# EasyEDA Pro project ProDoc_MotherBrd_2025-10-13.epro, schematic MotherBoard
Board Name: MotherBrd; Create Date: 2025-09-12; Page Name: P1; Project Name: STM32 Desktop Drumkit v1; Schematic Name: MotherBoard; Update Date: 2025-09-14; Company: CQUPT; Drawed: WilliTourt; Page Size: A4; Reviewed: WilliTourt; Version: V1.0
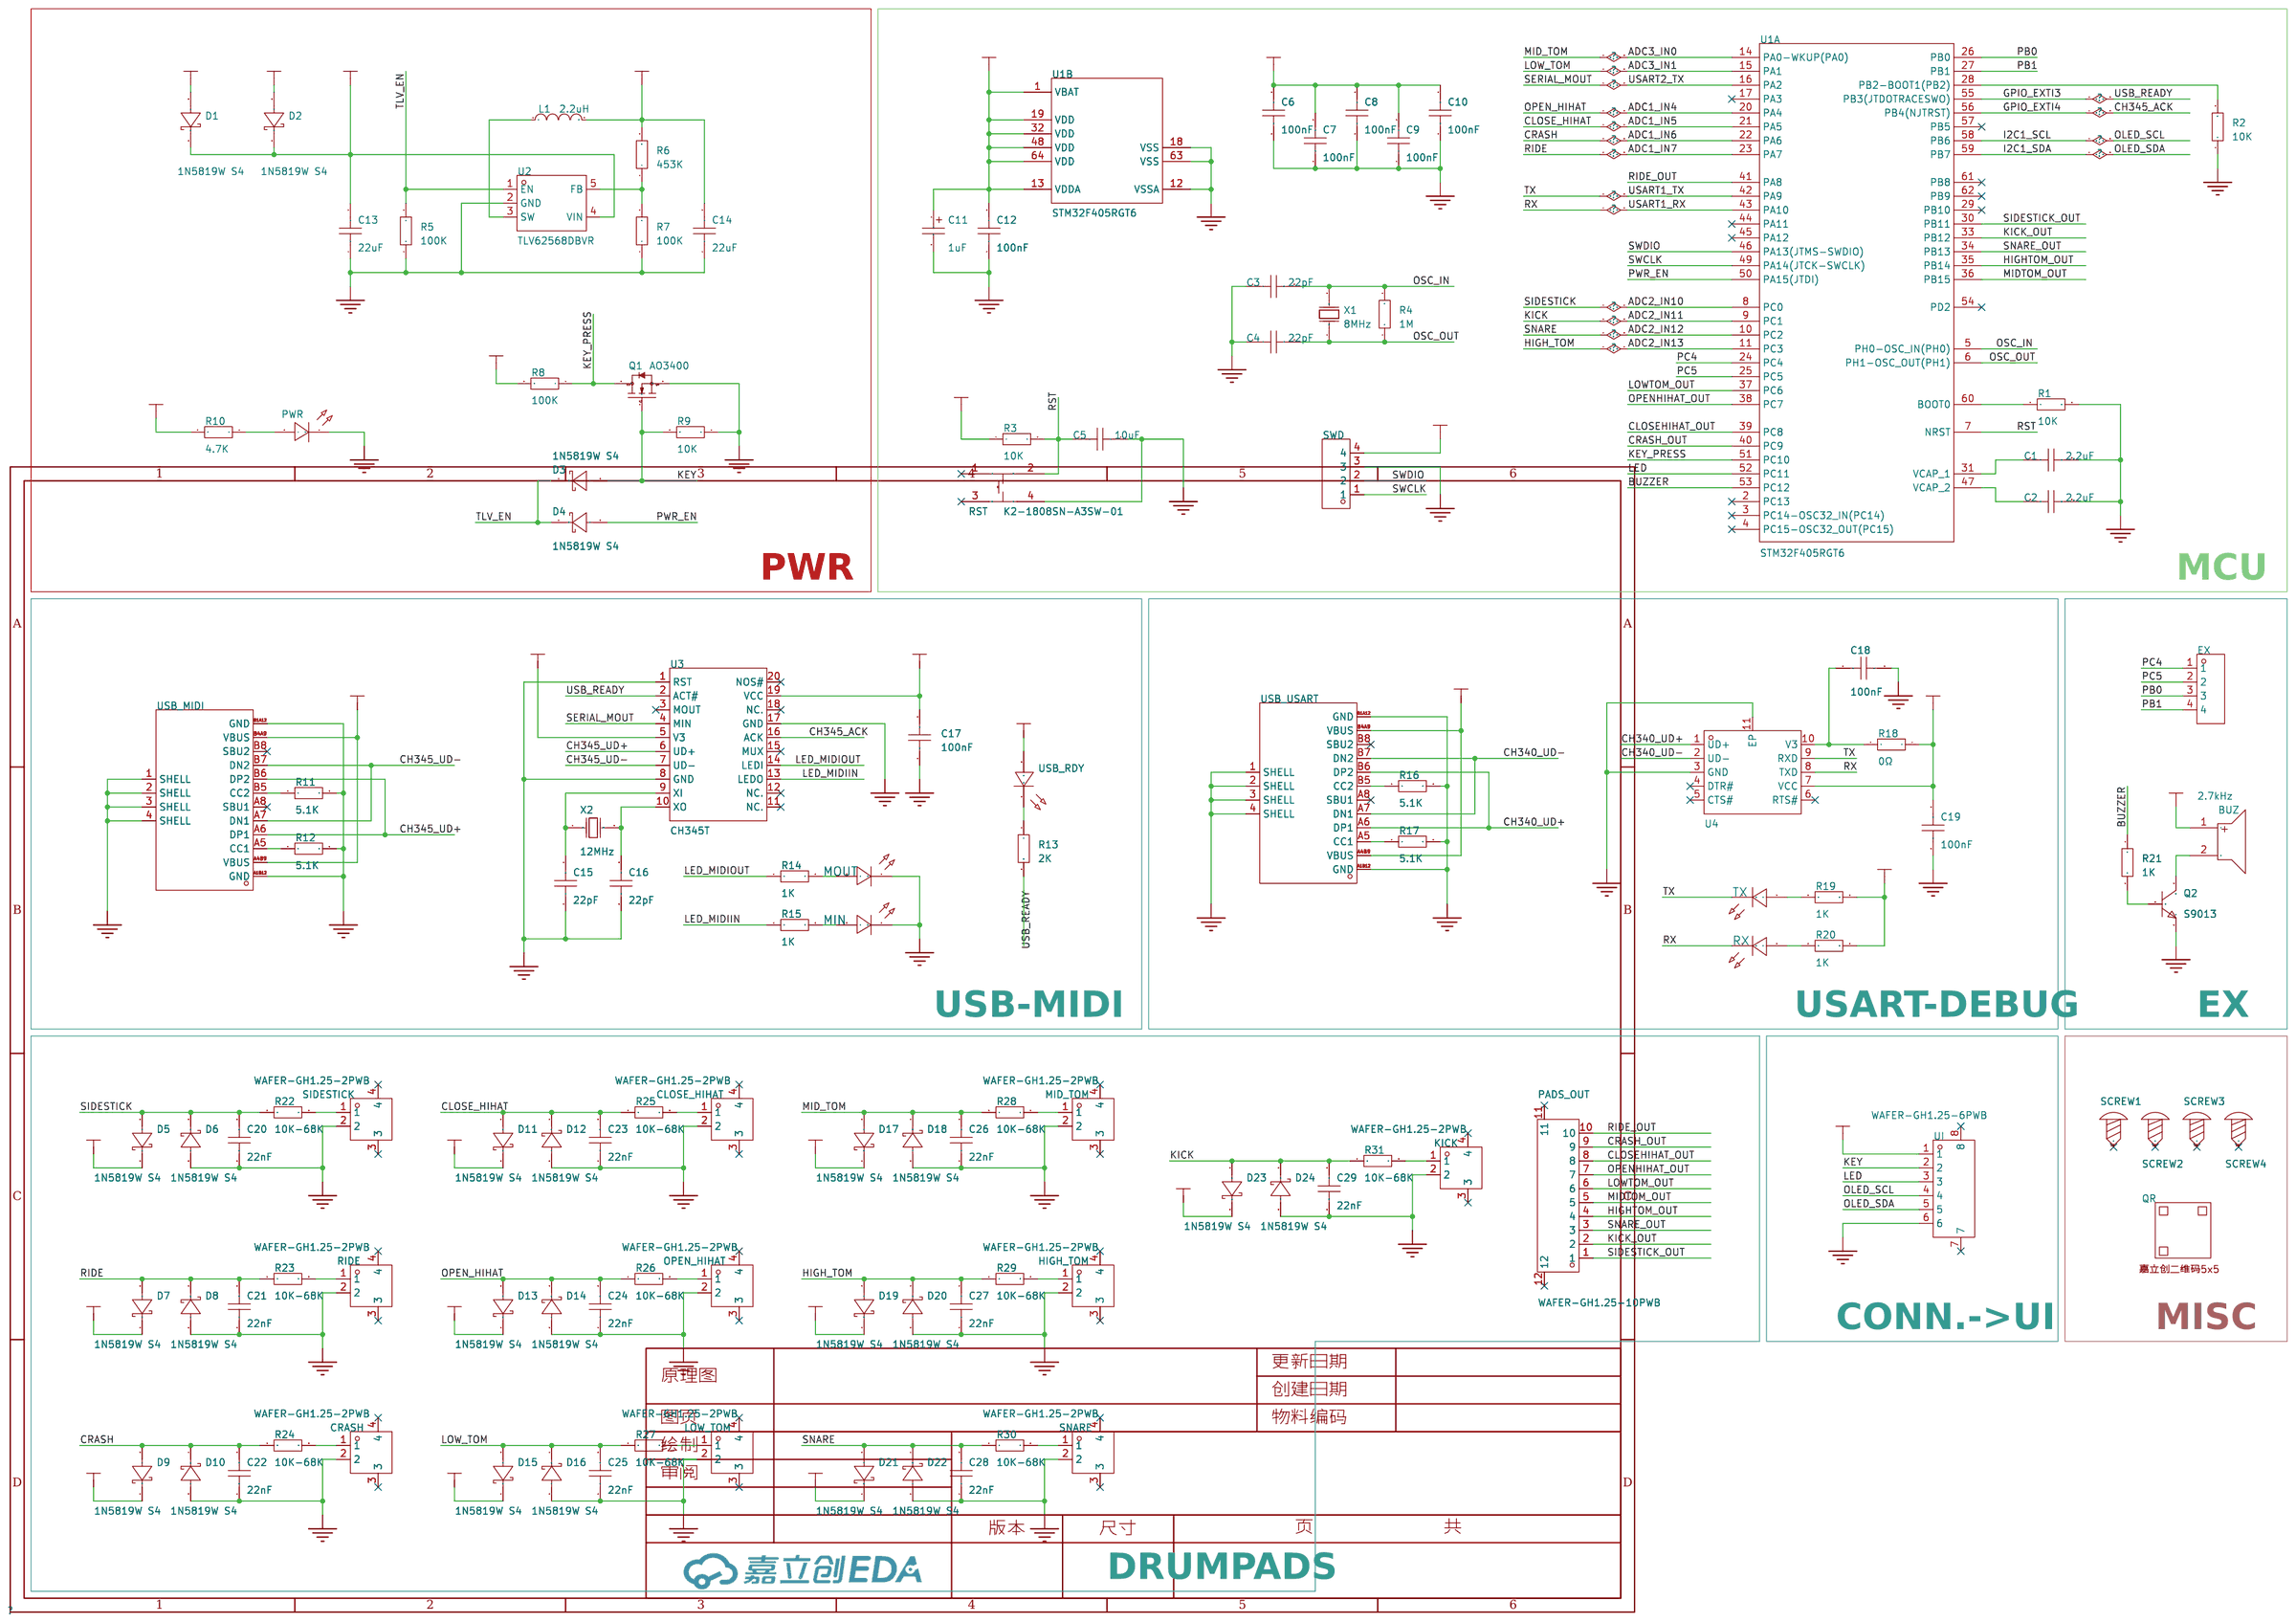
[diagram p0: schematic sheet]

## Parts
BUZ  2.7kHz  [BUZ-TH_BD9.0-P4.00-D0.6-FD]
C1  2.2uF  [C0603]
C2  2.2uF  [C0603]
C3  22pF  [C0603]
C4  22pF  [C0603]
C5  10uF  [C0603]
C6  100nF  [C0603]
C7  100nF  [C0603]
C8  100nF  [C0603]
C9  100nF  [C0603]
C10  100nF  [C0603]
C11  1uF  [CASE-A_3216]
C12  100nF  [C0603]
C13  22uF  [C0603]
C14  22uF  [C0603]
C15  22pF  [C0603]
C16  22pF  [C0603]
C17  100nF  [C0603]
C18  100nF  [C0603]
C19  100nF  [C0603]
C20  22nF  [C0603]
C21  22nF  [C0603]
C22  22nF  [C0603]
C23  22nF  [C0603]
C24  22nF  [C0603]
C25  22nF  [C0603]
C26  22nF  [C0603]
C27  22nF  [C0603]
C28  22nF  [C0603]
C29  22nF  [C0603]
CLOSE_HIHAT  WAFER-GH1.25-2PWB  [CONN-TH_2P-P1.25_XUNPU_WAFER-GH1.25-2PWB]
CRASH  WAFER-GH1.25-2PWB  [CONN-TH_2P-P1.25_XUNPU_WAFER-GH1.25-2PWB]
D1  1N5819W S4  [SOD-123_L2.7-W1.6-LS3.7-RD]
D2  1N5819W S4  [SOD-123_L2.7-W1.6-LS3.7-RD]
D3  1N5819W S4  [SOD-123_L2.7-W1.6-LS3.7-RD]
D4  1N5819W S4  [SOD-123_L2.7-W1.6-LS3.7-RD]
D5  1N5819W S4  [SOD-123_L2.7-W1.6-LS3.7-RD]
D6  1N5819W S4  [SOD-123_L2.7-W1.6-LS3.7-RD]
D7  1N5819W S4  [SOD-123_L2.7-W1.6-LS3.7-RD]
D8  1N5819W S4  [SOD-123_L2.7-W1.6-LS3.7-RD]
D9  1N5819W S4  [SOD-123_L2.7-W1.6-LS3.7-RD]
D10  1N5819W S4  [SOD-123_L2.7-W1.6-LS3.7-RD]
D11  1N5819W S4  [SOD-123_L2.7-W1.6-LS3.7-RD]
D12  1N5819W S4  [SOD-123_L2.7-W1.6-LS3.7-RD]
D13  1N5819W S4  [SOD-123_L2.7-W1.6-LS3.7-RD]
D14  1N5819W S4  [SOD-123_L2.7-W1.6-LS3.7-RD]
D15  1N5819W S4  [SOD-123_L2.7-W1.6-LS3.7-RD]
D16  1N5819W S4  [SOD-123_L2.7-W1.6-LS3.7-RD]
D17  1N5819W S4  [SOD-123_L2.7-W1.6-LS3.7-RD]
D18  1N5819W S4  [SOD-123_L2.7-W1.6-LS3.7-RD]
D19  1N5819W S4  [SOD-123_L2.7-W1.6-LS3.7-RD]
D20  1N5819W S4  [SOD-123_L2.7-W1.6-LS3.7-RD]
D21  1N5819W S4  [SOD-123_L2.7-W1.6-LS3.7-RD]
D22  1N5819W S4  [SOD-123_L2.7-W1.6-LS3.7-RD]
D23  1N5819W S4  [SOD-123_L2.7-W1.6-LS3.7-RD]
D24  1N5819W S4  [SOD-123_L2.7-W1.6-LS3.7-RD]
EX  -  [HDR-TH_4P-P2.54-V-F]
HIGH_TOM  WAFER-GH1.25-2PWB  [CONN-TH_2P-P1.25_XUNPU_WAFER-GH1.25-2PWB]
KICK  WAFER-GH1.25-2PWB  [CONN-TH_2P-P1.25_XUNPU_WAFER-GH1.25-2PWB]
L1  2.2uH  [IND-SMD_L3.0-W3.0_FNR30XXS]
LOW_TOM  WAFER-GH1.25-2PWB  [CONN-TH_2P-P1.25_XUNPU_WAFER-GH1.25-2PWB]
MID_TOM  WAFER-GH1.25-2PWB  [CONN-TH_2P-P1.25_XUNPU_WAFER-GH1.25-2PWB]
MIN  -  [LED0603]
MOUT  -  [LED0603]
OPEN_HIHAT  WAFER-GH1.25-2PWB  [CONN-TH_2P-P1.25_XUNPU_WAFER-GH1.25-2PWB]
PADS_OUT  WAFER-GH1.25-10PWB  [CONN-SMD_10P-P1.25_XUNPU_WAFER-GH1.25-10PWB]
PWR  -  [LED0603]
Q1  AO3400  [SOT-23-3_L2.9-W1.3-P1.90-LS2.4-BR]
Q2  S9013  [SOT-23-3_L2.9-W1.4-P1.90-LS2.6-BR]
QR  -  [JLC-QRCODE-5x5]
R1  10K  [R0603]
R2  10K  [R0603]
R3  10K  [R0603]
R4  1M  [R0603]
R5  100K  [R0603]
R6  453K  [R0603]
R7  100K  [R0603]
R8  100K  [R0603]
R9  10K  [R0603]
R10  4.7K  [R0603]
R11  5.1K  [R0603]
R12  5.1K  [R0603]
R13  2K  [R0603]
R14  1K  [R0603]
R15  1K  [R0603]
R16  5.1K  [R0603]
R17  5.1K  [R0603]
R18  0Ω  [R0603]
R19  1K  [R0603]
R20  1K  [R0603]
R21  1K  [R0603]
R22  10K-68K  [R0603]
R23  10K-68K  [R0603]
R24  10K-68K  [R0603]
R25  10K-68K  [R0603]
R26  10K-68K  [R0603]
R27  10K-68K  [R0603]
R28  10K-68K  [R0603]
R29  10K-68K  [R0603]
R30  10K-68K  [R0603]
R31  10K-68K  [R0603]
RIDE  WAFER-GH1.25-2PWB  [CONN-TH_2P-P1.25_XUNPU_WAFER-GH1.25-2PWB]
RST  K2-1808SN-A3SW-01  [SW-SMD_4P-L4.2-W3.3-P2.15-LS5.1]
RX  -  [LED0603]
SCREW1  -  [M2螺丝]
SCREW2  -  [M2螺丝]
SCREW3  -  [M2螺丝]
SCREW4  -  [M2螺丝]
SIDESTICK  WAFER-GH1.25-2PWB  [CONN-TH_2P-P1.25_XUNPU_WAFER-GH1.25-2PWB]
SNARE  WAFER-GH1.25-2PWB  [CONN-TH_2P-P1.25_XUNPU_WAFER-GH1.25-2PWB]
SWD  -  [HDR-TH_4P-P2.54-V-F]
TX  -  [LED0603]
U1  STM32F405RGT6  [LQFP-64_L10.0-W10.0-P0.50-LS12.0-BL]  (sections 1,2)
U2  TLV62568DBVR  [SOT-23-5_L3.0-W1.7-P0.95-LS2.8-BR]
U3  CH345T  [SSOP-20_L7.2-W5.3-P0.65-LS7.8-BL]
U4  CH340K  [ESOP-10_L4.9-W3.9-P1.00-LS6.2-BL-EP]
UI  WAFER-GH1.25-6PWB  [CONN-SMD_6P-P1.25_XUNPU_WAFER-GH1.25-6PWB]
USB_MIDI  Type-C-TOP_1  [USB-C-SMD_TYPE-C16PIN]
USB_RDY  -  [LED0603]
USB_USART  Type-C-TOP_1  [USB-C-SMD_TYPE-C16PIN]
X1  8MHz  [CRYSTAL-SMD_L5.0-W3.2]
X2  12MHz  [OSC-SMD_L5.0-W3.2]

## Library data of the parts
BUZ = QMB-09B-03: 驱动方式:无源(外部驱动);构造类型:电磁式;频率:2.7kHz;声压(SPL):85dB;; LCSC Part Name: 无源蜂鸣器QMB-09B-03; Supplier Part: C96256; Manufacturer: 华能; Supplier Footprint: 插件,D=9mm; JLCPCB Part Class: 扩展库; Datasheet: https://atta.szlcsc.com/upload/public/pdf/source/20210401/C96256_958B17753B5AD7CBFBCFFC7C095B4484.pdf; Supplier: LCSC; Driver Circuitry: 无源(外部驱动); Technology: 电磁式; Voltage - Supply: 2V~5V; Sound Pressure Level(SPL): 85dB; Diameter(φD): 9mm; Height: 5.7mm; Oscillator Circuit: 无源(外部驱动); Technology Type: 电磁式; Operating Voltage: 2V~5V; Sound Pressure Level (SPL): 85dB@3V,10cm; Diameter (φD): 9mm
C1-C10 C12-C29 = C0603: Supplier Footprint: 0603
C11 = TAJA105K016RNJ: 容值:1uF;精度:±10%;额定电压:16V;等效串联电阻(ESR):11Ω;; LCSC Part Name: 1uF ±10% 16V; Supplier Part: C7174; Manufacturer: Kyocera AVX; Supplier Footprint: CASE-A-3216-18(mm); JLCPCB Part Class: 扩展库; Supplier: LCSC; Tolerance: ±10%; Voltage Rating: 16V; Equivalent Series Resistance(ESR): 11Ω; Operating Temperature: -55℃~+125℃
CLOSE_HIHAT CRASH HIGH_TOM KICK LOW_TOM MID_TOM OPEN_HIHAT RIDE SIDESTICK SNARE = WAFER-GH1.25-2PWB: 插针结构:1x2P;间距:1.25mm;安装方式:卧贴;参考系列:GH;总PIN数:2P;排数:1;每排PIN数:2;行距:-;额定电流:1A;触头材质:黄铜;触头镀层:-;工作温度范围:-25℃~+85℃;; LCSC Part Name: 1x2P 间距:1.25mm 卧贴 系列:GH; Supplier Part: C3029377; Manufacturer: XUNPU(讯普); Supplier Footprint: SMD,P=1.25mm,卧贴; JLCPCB Part Class: 扩展库; Datasheet: https://atta.szlcsc.com/upload/public/pdf/source/20220527/CB8773BFB0913C3B8ABD62CB38BA101A.pdf; Supplier: LCSC; Pins Structure: 1x2P; Pitch: 1.25mm; Mounting Type: 卧贴; Reference Series: GH; Number of Pins: 2P; Number of Rows: 1; Number of PINs Per Row: 2; Current Rating: 1A; Contact Material: 黄铜; Operating Temperature: -25℃~+85℃; Voltage Rating: 125V; Plastic Material: LCP; Supplementary Features: 辅助焊脚; Color: 米色; Z-Height of the Board: 4.35mm; X-Length of Bottom Edge on Board (Spacing Line): 5.75mm; Y-Width of Bottom Edge on Board: 5mm
D1-D24 = 1N5819W S4_1: Supplier Part: C42441798; Manufacturer: TDSEMIC(拓电半导体); Supplier Footprint: SOD-123FL; Datasheet: https://atta.szlcsc.com/upload/public/pdf/source/20250110/C8BCE7F7EDFAC688AB53FBC3883F650D.pdf; Supplier: LCSC
EX SWD = HDR-F_2.54_1x4P: Supplier Part: C2718488; Supplier Footprint: 插件
L1 = FNR3015S2R2MT: 电感值:2.2uH;精度:±20%;额定电流:2A;饱和电流(Isat):2A;; LCSC Part Name: 2.2uH ±20% 2A; Supplier Part: C167747; Manufacturer: cjiang(长江微电); Supplier Footprint: SMD,3x3mm; JLCPCB Part Class: 扩展库; Datasheet: https://atta.szlcsc.com/upload/public/pdf/source/20190327/C167925_9EFF0AABC4CA629C2CC95961DBF7D39D.pdf; Supplier: LCSC; Tolerance: ±20%; Rated Current: 2A; Saturation Current (Isat): 2A; DC Resistance (DCR): 78mΩ
MIN MOUT RX TX = LED0603-ORANGE: Supplier Footprint: 0603
PADS_OUT = WAFER-GH1.25-10PWB: 插针结构:1x10P;间距:1.25mm;安装方式:卧贴;参考系列:GH;总PIN数:10P;排数:1;每排PIN数:10;行距:-;额定电流:1A;触头材质:黄铜;触头镀层:-;工作温度范围:-25℃~+85℃;; LCSC Part Name: 1x10P 间距:1.25mm 卧贴 系列:GH; Supplier Part: C3029385; Manufacturer: XUNPU(讯普); Supplier Footprint: SMD,P=1.25mm,卧贴; JLCPCB Part Class: 扩展库; Datasheet: https://atta.szlcsc.com/upload/public/pdf/source/20220527/CB8773BFB0913C3B8ABD62CB38BA101A.pdf; Supplier: LCSC; Pins Structure: 1x10P; Pitch: 1.25mm; Mounting Type: 卧贴; Reference Series: GH; Number of Pins: 10P; Number of Rows: 1; Number of PINs Per Row: 10; Current Rating: 1A; Contact Material: 黄铜; Operating Temperature: -25℃~+85℃; Voltage Rating: 125V; Plastic Material: LCP; Supplementary Features: 辅助焊脚; Color: 米色; Z-Height of the Board: 4.35mm; X-Length of Bottom Edge on Board (Spacing Line): 15.75mm; Y-Width of Bottom Edge on Board: 5mm
PWR USB_RDY = LED0603-GREEN
Q1 = AO3400_C181090: 数量:1个N沟道;漏源电压(Vdss):30V;连续漏极电流(Id):5.8A;导通电阻(RDS(on)):28mΩ@10V,5.8A;耗散功率(Pd):1.4W;阈值电压(Vgs(th)):1.45V@250uA;; LCSC Part Name: 1个N沟道 耐压:30V 电流:5.8A; Supplier Part: C181090; Manufacturer: Hottech(合科泰); Supplier Footprint: SOT-23; JLCPCB Part Class: 扩展库; Datasheet: https://item.szlcsc.com/datasheet/AO3400/192487.html; Supplier: LCSC; Number: 1个N沟道; Drain to Source Voltage: 30V; Current - Continuous Drain(Id): 5.8A; RDS(on): 28mΩ@10V,5.8A; Pd - Power Dissipation: 1.4W; Gate Threshold Voltage (Vgs(th)): 1.45V@250uA; Gate Charge(Qg): 7nC@4.5V; Input Capacitance(Ciss): 630pF; Reverse Transfer Capacitance (Crss@Vds): 50pF; Type: N沟道; Output Capacitance(Coss): 75pF
Q2 = S9013_C2836092: 晶体管类型:NPN;集电极电流(Ic):500mA;集射极击穿电压(Vceo):25V;功率(Pd):300mW;直流电流增益(hFE@Ic,Vce):120@50mA,1V;; LCSC Part Name: J3(J3表示丝印); Supplier Part: C2836092; Manufacturer: CBI(创基); Supplier Footprint: SOT-23; JLCPCB Part Class: 扩展库; Datasheet: https://atta.szlcsc.com/upload/public/pdf/source/20210621/C2836092_15188A6897D44309F7F2A6D715C57DA2.pdf; Supplier: LCSC; Transistor Type: NPN; Collector Current (Ic): 500mA; Collector-Emitter Breakdown Voltage (Vceo): 25V; Power Dissipation (Pd): 300mW; DC Current Gain (hFE@Ic,Vce): 120@50mA,1V; Transition Frequency (fT): 150MHz; Collector Cut-Off Current (Icbo): 100nA; Collector-Emitter Saturation Voltage (VCE(sat)@Ic,Ib): 600mV@500mA,50mA
QR = 嘉立创二维码5x5
R1-R31 = R0603: Supplier Footprint: 0603
RST = K2-1808SN-A3SW-01: 作用力:180gf;安装方式:立贴;开关长度:4.2mm;开关宽度:3.25mm;开关高度:2.5mm;触点电流:50mA;额定电压(DC):12V;绝缘电阻:100MΩ;机械寿命:10万次;; LCSC Part Name: 3*4*2.5 贴片开关180G; Supplier Part: C2690012; Manufacturer: 韩国韩荣; Supplier Footprint: SMD; JLCPCB Part Class: 扩展库; Datasheet: https://atta.szlcsc.com/upload/public/pdf/source/20180927/C283535_7E7907F3E7B6C1691E1DC87E363D082A.pdf; Supplier: LCSC; Operating Force: 180gf; Mounting Style: 立贴; Switch Length: 4.2mm; Switch Width: 3.25mm; Switch Height: 2.5mm; Contact Current: 50mA; Voltage Rating (DC): 12V; Insulation Resistance: 100MΩ; Mechanical Life: 10万次; Operating Temperature: -25℃~+85℃
SCREW1-SCREW4 = M2螺丝: Supplier Footprint: 插件
U1 = STM32F405RGT6: CPU内核:ARM-M4;CPU最大主频:168MHz;应用领域:-;; LCSC Part Name: 带DSP和FPU的高性能基础系列ARM Cortex-M4 MCU，具有1 MB Flash、168 MHz CPU和ART加速器; Supplier Part: C15742; Manufacturer: ST(意法半导体); Supplier Footprint: LQFP-64(10x10); JLCPCB Part Class: 扩展库; Datasheet: https://item.szlcsc.com/datasheet/STM32F405RGT6/16424.html; Supplier: LCSC; CPU Core: ARM-M4; CPU Maximum Speed: 168MHz; Program Storage Size: 1MB; Program Memory Type: FLASH; Number of I/O: 51; ADC (Bit): 12bit; DAC (Bit): 12bit; Voltage - Supply: 1.8V~3.6V
U2 = TLV62568DBVR: 功能类型:降压型;输出类型:可调;工作电压:2.5V~5.5V;输出电压:600mV~5.5V;输出电流:1A;; LCSC Part Name: 1A高效同步降压转换器; Supplier Part: C163219; Manufacturer: TI(德州仪器); Supplier Footprint: SOT-23-5; JLCPCB Part Class: 扩展库; Datasheet: https://www.ti.com/cn/lit/gpn/tlv62568; Supplier: LCSC; Function: 降压型; Output Type: 可调; Input Voltage: 2.5V~5.5V; Output Voltage: 600mV~5.5V; Output Current: 1A; Switching Frequency: 1.5MHz; Operating Temperature: -40℃~+125℃@(TJ); Synchronous Rectification: 是; Number of Outputs: 1; Topology: 降压式; Switch tube (built-in/external): 内置
U3 = CH345T: CH345是一个USB转MIDI芯片。CH345支持一个MIDI信号输入通道和两个MIDI信号输出通道，用于制作USB总线的MIDI键盘，MIDI音乐回放，以及将MIDI电子乐器转换为USB接口。; Supplier Part: C5246448; Manufacturer: WCH(南京沁恒); Supplier Footprint: SSOP-20; JLCPCB Part Class: 扩展库; Datasheet: https://item.szlcsc.com/datasheet/CH345T/5956842.html; Supplier: LCSC
U4 = CH340K: 应用功能:USB转串口;接口协议:USB 2.0;通道数:-;数据速率:2Mbps;; LCSC Part Name: USB转串口芯片CH340; Supplier Part: C968586; Manufacturer: WCH(南京沁恒); Supplier Footprint: ESSOP-10-150mil-1mm; JLCPCB Part Class: 扩展库; Datasheet: https://atta.szlcsc.com/upload/public/pdf/source/20240313/C21A12AB66F63ABF8F8743FF13A35C95.pdf; Supplier: LCSC; Applications Function: USB转串口; Protocol: USB 2.0; Voltage - Supply: 3.3V；5V; Data Rate: 2Mbps; Operating Temperature: -20℃~+70℃
UI = WAFER-GH1.25-6PWB: 插针结构:1x6P;间距:1.25mm;安装方式:卧贴;参考系列:GH;总PIN数:6P;排数:1;每排PIN数:6;行距:-;额定电流:1A;触头材质:黄铜;触头镀层:-;工作温度范围:-25℃~+85℃;; LCSC Part Name: 1x6P 间距:1.25mm 卧贴 系列:GH; Supplier Part: C3029381; Manufacturer: XUNPU(讯普); Supplier Footprint: SMD,P=1.25mm,卧贴; JLCPCB Part Class: 扩展库; Datasheet: https://atta.szlcsc.com/upload/public/pdf/source/20220527/CB8773BFB0913C3B8ABD62CB38BA101A.pdf; Supplier: LCSC; Pins Structure: 1x6P; Pitch: 1.25mm; Mounting Type: 卧贴; Reference Series: GH; Number of Pins: 6P; Number of Rows: 1; Number of PINs Per Row: 6; Current Rating: 1A; Contact Material: 黄铜; Operating Temperature: -25℃~+85℃; Voltage Rating: 125V; Plastic Material: LCP; Supplementary Features: 辅助焊脚; Color: 米色; Z-Height of the Board: 4.35mm; X-Length of Bottom Edge on Board (Spacing Line): 10.75mm; Y-Width of Bottom Edge on Board: 5mm
USB_MIDI USB_USART = Type-C-TOP_1: Supplier Part: C9900005857; Supplier Footprint: Type-C16P; JLCPCB Part Class: 扩展库; Supplier: LCSC; Check: false
X1 = X50328MSB2GI: 晶振类型:贴片晶振;频率:8MHz;常温频差:±10ppm;外接负载电容:20pF;频率稳定度(全温):±20ppm;; LCSC Part Name: 8MHz ±10ppm 20pF YSX530GA; Supplier Part: C115962; Manufacturer: YXC(扬兴晶振); Supplier Footprint: SMD5032; JLCPCB Part Class: 基础库; Datasheet: https://atta.szlcsc.com/upload/public/pdf/source/20240329/44922B0AF7B60E58E9B66993B6077277.pdf; Supplier: LCSC; Crystal Type: 贴片晶振; Normal temperature Frequency Tolerance: ±10ppm; External load capacitor: 20pF; Frequency Stability(Full temperature range): ±20ppm; Operating Temperature: -40℃~+85℃
X2 = X503212MSB2GI: 晶振类型:贴片晶振;频率:12MHz;常温频差:±10ppm;负载电容:20pF;频率稳定度:±20ppm;; LCSC Part Name: YSX530GA 12MHZ 2P 5032 20PF ±10PPM -40~85℃ (±20PPM); Supplier Part: C112573; Manufacturer: YXC(扬兴晶振); Supplier Footprint: SMD5032-2P; JLCPCB Part Class: 扩展库; Datasheet: https://item.szlcsc.com/datasheet/X503212MSB2GI/113806.html; Supplier: LCSC; Type: 贴片晶振; Normal temperature Frequency Tolerance: ±10ppm; Load Capacitance: 20pF; Frequency Stability: ±20ppm; Operating Temperature: -40℃~+85℃

## Nets
3V3: BUZ.1 C6.2 C7.2 C8.2 C9.2 C10.2 C11.1 C12.2 C14.2 C17.1 C19.2 D5.1(C) D7.1(C) D9.1(C) D11.1(C) D13.1(C) D15.1(C) D17.1(C) D19.1(C) D21.1(C) D23.1(C) L1.2 R3.1 R6.2 R8.2 R10.2 R18.1 R19.2 R20.2 SWD.4 U1.1(VBAT) U1.13(VDDA) U1.19(VDD) U1.32(VDD) U1.48(VDD) U1.64(VDD) U3.5(V3) U3.19(VCC) U4.7(VCC) USB_RDY.2(A)
5V: C13.2 D1.1(C) D2.1(C) U2.4(VIN) UI.1
5V_MIDI: D1.2(A) USB_MIDI.A4B9(VBUS) USB_MIDI.B4A9(VBUS)
5V_USART: D2.2(A) USB_USART.A4B9(VBUS) USB_USART.B4A9(VBUS)
GND: C1.2 C2.2 C3.1 C4.1 C5.2 C6.1 C7.1 C8.1 C9.1 C10.1 C11.2 C12.1 C13.1 C14.1 C15.1 C16.1 C17.2 C18.1 C19.1 C20.1 C21.1 C22.1 C23.1 C24.1 C25.1 C26.1 C27.1 C28.1 C29.1 CLOSE_HIHAT.2 CRASH.2 D6.2(A) D8.2(A) D10.2(A) D12.2(A) D14.2(A) D16.2(A) D18.2(A) D20.2(A) D22.2(A) D24.2(A) HIGH_TOM.2 KICK.2 LOW_TOM.2 MID_TOM.2 MIN.1(C) MOUT.1(C) OPEN_HIHAT.2 PWR.1(C) Q1.2(S) Q2.2(E) R1.2 R2.1 R5.1 R7.1 R9.1 R11.2 R12.2 R16.2 R17.2 RIDE.2 RST.4 SIDESTICK.2 SNARE.2 SWD.3 U1.12(VSSA) U1.18(VSS) U1.63(VSS) U2.2(GND) U3.1(RST) U3.8(GND) U3.17(GND) U4.3(GND) U4.11(EP) UI.6 USB_MIDI.1(SHELL) USB_MIDI.2(SHELL) USB_MIDI.3(SHELL) USB_MIDI.4(SHELL) USB_MIDI.A1B12(GND) USB_MIDI.B1A12(GND) USB_USART.1(SHELL) USB_USART.2(SHELL) USB_USART.3(SHELL) USB_USART.4(SHELL) USB_USART.A1B12(GND) USB_USART.B1A12(GND)
ADC1_IN4: C24.2 D13.2(A) D14.1(C) R26.1 U1.20(PA4)
ADC1_IN5: C23.2 D11.2(A) D12.1(C) R25.1 U1.21(PA5)
ADC1_IN6: C22.2 D9.2(A) D10.1(C) R24.1 U1.22(PA6)
ADC1_IN7: C21.2 D7.2(A) D8.1(C) R23.1 U1.23(PA7)
ADC2_IN10: C20.2 D5.2(A) D6.1(C) R22.1 U1.8(PC0)
ADC2_IN11: C29.2 D23.2(A) D24.1(C) R31.1 U1.9(PC1)
ADC2_IN12: C28.2 D21.2(A) D22.1(C) R30.1 U1.10(PC2)
ADC2_IN13: C27.2 D19.2(A) D20.1(C) R29.1 U1.11(PC3)
ADC3_IN0: C26.2 D17.2(A) D18.1(C) R28.1 U1.14(PA0-WKUP(PA0))
ADC3_IN1: C25.2 D15.2(A) D16.1(C) R27.1 U1.15(PA1)
BUZZER: R21.1 U1.53(PC12)
CH340_UD+: U4.1(UD+) USB_USART.A6(DP1) USB_USART.B6(DP2)
CH340_UD-: U4.2(UD-) USB_USART.A7(DN1) USB_USART.B7(DN2)
CH345_ACK: U1.56(PB4(NJTRST)) U3.16(ACK)
CH345_UD+: U3.6(UD+) USB_MIDI.A6(DP1) USB_MIDI.B6(DP2)
CH345_UD-: U3.7(UD-) USB_MIDI.A7(DN1) USB_MIDI.B7(DN2)
CLOSEHIHAT_OUT: PADS_OUT.8 U1.39(PC8)
CRASH_OUT: PADS_OUT.9 U1.40(PC9)
GPIO_EXTI3: R13.2 U1.55(PB3(JTDOTRACESWO)) U3.2(ACT#)
HIGHTOM_OUT: PADS_OUT.4 U1.35(PB14)
I2C1_SCL: U1.58(PB6) UI.4
I2C1_SDA: U1.59(PB7) UI.5
KEY: D3.2(A) Q1.1(G) R9.2 UI.2
KEY_PRESS: Q1.3(D) R8.1 U1.51(PC10)
KICK_OUT: PADS_OUT.2 U1.33(PB12)
LED: U1.52(PC11) UI.3
LED_MIDIIN: R15.1 U3.13(LEDO)
LED_MIDIOUT: R14.1 U3.14(LEDI)
LOWTOM_OUT: PADS_OUT.6 U1.37(PC6)
MIDTOM_OUT: PADS_OUT.5 U1.36(PB15)
OPENHIHAT_OUT: PADS_OUT.7 U1.38(PC7)
OSC_IN: C3.2 R4.2 U1.5(PH0-OSC_IN(PH0)) X1.2(OSC2)
OSC_OUT: C4.2 R4.1 U1.6(PH1-OSC_OUT(PH1)) X1.1(OSC1)
PB0: EX.3 U1.26(PB0)
PB1: EX.4 U1.27(PB1)
PC4: EX.1 U1.24(PC4)
PC5: EX.2 U1.25(PC5)
PWR_EN: D4.2(A) U1.50(PA15(JTDI))
RIDE_OUT: PADS_OUT.10 U1.41(PA8)
RST: C5.1 R3.2 RST.2 U1.7(NRST)
RX: RX.1(C) U1.43(PA10) U4.8(TXD)
SERIAL_MOUT: U1.16(PA2) U3.4(MIN)
SIDESTICK_OUT: PADS_OUT.1 U1.30(PB11)
SNARE_OUT: PADS_OUT.3 U1.34(PB13)
SWCLK: SWD.1 U1.49(PA14(JTCK-SWCLK))
SWDIO: SWD.2 U1.46(PA13(JTMS-SWDIO))
TLV_EN: D3.1(C) D4.1(C) R5.2 U2.1(EN)
TX: TX.1(C) U1.42(PA9) U4.9(RXD)
$1N1371: C18.2 R18.2 U4.10(V3)
$1N4897: MOUT.2(A) R14.2
$1N4901: MIN.2(A) R15.2
$1N6007: R6.1 R7.2 U2.5(FB)
$1N6012: L1.1 U2.3(SW)
$1N7140: BUZ.2 Q2.3(C)
$1N7141: Q2.1(B) R21.2
$1N8066: R19.1 TX.2(A)
$1N8071: R20.1 RX.2(A)
$1N9517: PWR.2(A) R10.1
$1N12501: R23.2 RIDE.1
$1N13566: R30.2 SNARE.1
$1N13718: KICK.1 R31.2
Net-(C1-1): C1.1 U1.31(VCAP_1)
Net-(C2-1): C2.1 U1.47(VCAP_2)
Net-(C15-2): C15.2 U3.9(XI) X2.1(OSC1)
Net-(C16-2): C16.2 U3.10(XO) X2.2(OSC2)
Net-(CLOSE_HIHAT-1): CLOSE_HIHAT.1 R25.2
Net-(CRASH-1): CRASH.1 R24.2
Net-(HIGH_TOM-1): HIGH_TOM.1 R29.2
Net-(LOW_TOM-1): LOW_TOM.1 R27.2
Net-(MID_TOM-1): MID_TOM.1 R28.2
Net-(OPEN_HIHAT-1): OPEN_HIHAT.1 R26.2
Net-(R1-1): R1.1 U1.60(BOOT0)
Net-(R2-2): R2.2 U1.28(PB2-BOOT1(PB2))
Net-(R11-1): R11.1 USB_MIDI.B5(CC2)
Net-(R12-1): R12.1 USB_MIDI.A5(CC1)
Net-(R13-1): R13.1 USB_RDY.1(C)
Net-(R16-1): R16.1 USB_USART.B5(CC2)
Net-(R17-1): R17.1 USB_USART.A5(CC1)
Net-(R22-2): R22.2 SIDESTICK.1

Not connected (* = marked no-connect by the designer): CLOSE_HIHAT 3* 4*; CRASH 3* 4*; HIGH_TOM 3* 4*; KICK 3* 4*; LOW_TOM 3* 4*; MID_TOM 3* 4*; OPEN_HIHAT 3* 4*; PADS_OUT 11* 12*; RIDE 3* 4*; RST 1* 3*; SCREW1 1*; SCREW2 1*; SCREW3 1*; SCREW4 1*; SIDESTICK 3* 4*; SNARE 3* 4*; U1 2(PC13)* 3(PC14-OSC32_IN(PC14))* 4(PC15-OSC32_OUT(PC15))* 17(PA3)* 29(PB10)* 44(PA11)* 45(PA12)* 54(PD2)* 57(PB5)* 61(PB8)* 62(PB9)*; U3 3(MOUT)* 11(NC.)* 12(NC.)* 15(MUX)* 18(NC.)* 20(NOS#)*; U4 4(DTR#)* 5(CTS#)* 6(RTS#)*; UI 7* 8*; USB_MIDI A8(SBU1)* B8(SBU2)*; USB_USART A8(SBU1)* B8(SBU2)*

## Notes on the sheet
- PWR
- MCU
- USB-MIDI
- USART-DEBUG
- EX
- CONN.->UI
- MISC
- DRUMPADS
